# Altium schematic sheet FPGA_ETH.SchDoc
size A4; SheetNumber: 7; SheetTotal: 10
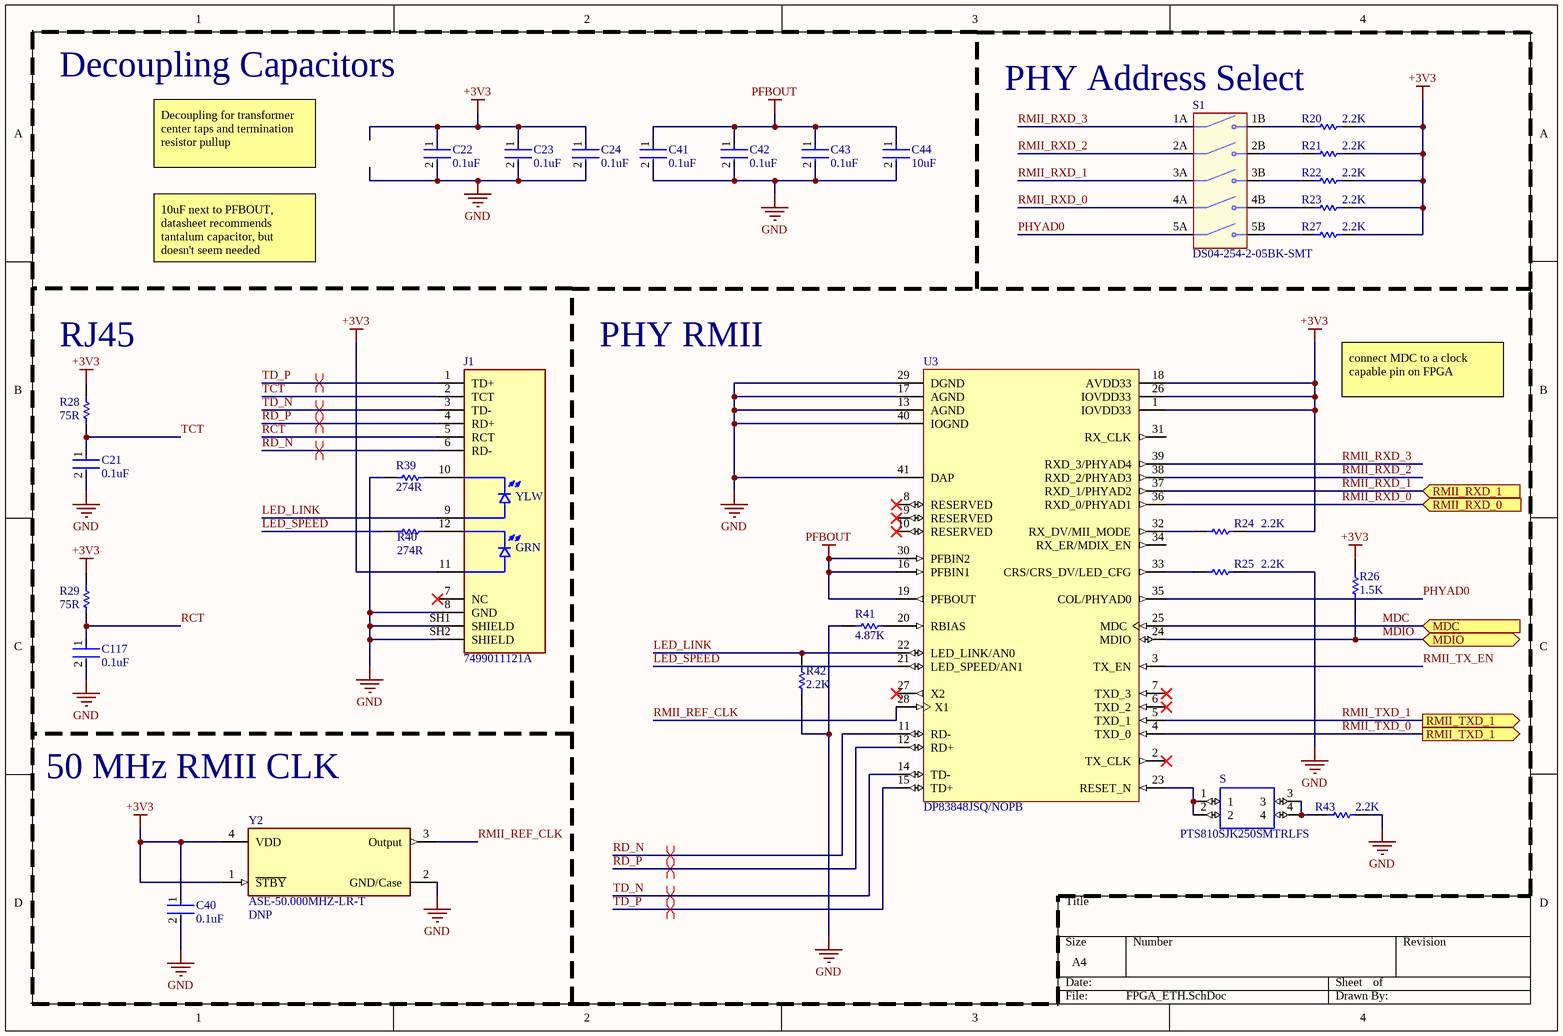
[diagram p0: FPGA_ETH.SchDoc]

## Parts
C21  0.1uF  [FP-CC0402-MFG]
C22  0.1uF  [FP-CC0402-MFG]
C23  0.1uF  [FP-CC0402-MFG]
C24  0.1uF  [FP-CC0402-MFG]
C40  0.1uF  [FP-CC0402-MFG]
C41  0.1uF  [FP-CC0402-MFG]
C42  0.1uF  [FP-CC0402-MFG]
C43  0.1uF  [FP-CC0402-MFG]
C44  10uF  [FP-GRM155-0_2-IPC_C]
C117  0.1uF  [FP-CC0402-MFG]
J1  7499011121A  [WE_7499011121A]
R20  2.2K  [RESC1005X40X25NL05T10]
R21  2.2K  [RESC1005X40X25NL05T10]
R22  2.2K  [RESC1005X40X25NL05T10]
R23  2.2K  [RESC1005X40X25NL05T10]
R24  2.2K  [RESC1005X40X25NL05T10]
R25  2.2K  [RESC1005X40X25NL05T10]
R26  1.5K  [RESC1005X40X25LL10T10]
R27  2.2K  [RESC1005X40X25NL05T10]
R28  75R  [RESC1608X55X25ML10T15]
R29  75R  [RESC1608X55X25ML10T15]
R39  274R  [RESC1608X55X25NL10T15]
R40  274R  [RESC1608X55X25NL10T15]
R41  4.87K  [RESC1005X40X25LL05T10]
R42  2.2K  [RESC1005X40X25NL05T10]
R43  2.2K  [RESC1005X40X25NL05T10]
S  PTS810SJK250SMTRLFS  [PTS810SJG250SMTRLFS]
S1  DS04-254-2-05BK-SMT  [SW_DS04-254-2-05BK-SMT]
U3  DP83848JSQ/NOPB  [RTA0040A_V]
Y2  ASE-50.000MHZ-LR-T  [FP-ASE-MFG]

## Ports
MDC (in), MDIO (bidir), RMII_RXD_0 (in), RMII_RXD_1 (in), RMII_TXD_1 (out)

## Nets
+3V3: C22.1 C23.1 C24.1 C40.1 J1.11(G_A) R20.2 R21.2 R22.2 R23.2 R24.2 R26.1 R27.2 R28.2 R29.2 U3.1(IOVDD33) U3.18(AVDD33) U3.26(IOVDD33) Y2.1(~{STBY}) Y2.4(VDD)
GND: C21.2 C22.2 C23.2 C24.2 C40.2 C41.2 C42.2 C43.2 C44.2 C117.2 J1.8(GND) J1.SH1(SHIELD) J1.SH2(SHIELD) R25.2 R39.2 R41.1 R42.2 R43.2 U3.13(AGND) U3.17(AGND) U3.29(DGND) U3.40(IOGND) U3.41(DAP) Y2.2(GND/Case)
PFBOUT: C41.1 C42.1 C43.1 C44.1 U3.16(PFBIN1) U3.19(PFBOUT) U3.30(PFBIN2)
LED_LINK: J1.9(Y_A) R42.1 U3.22(LED_LINK/AN0)
LED_SPEED: R40.2 U3.21(LED_SPEED/AN1)
MDC: U3.25(MDC) ; port MDC
MDIO: R26.2 U3.24(MDIO) ; port MDIO
PHYAD0: S1.5A(COM5) U3.35(COL/PHYAD0)
RCT: C117.1 J1.5(RCT) R29.1
RD_N: J1.6(RD-) U3.11(RD-)
RD_P: J1.4(RD+) U3.12(RD+)
RMII_REF_CLK: U3.28(X1) Y2.3(Output)
RMII_RXD_0: S1.4A(COM4) U3.36(RXD_0/PHYAD1) ; port RMII_RXD_0
RMII_RXD_1: S1.3A(COM3) U3.37(RXD_1/PHYAD2) ; port RMII_RXD_1
RMII_RXD_2: S1.2A(COM2) U3.38(RXD_2/PHYAD3)
RMII_RXD_3: S1.1A(COM1) U3.39(RXD_3/PHYAD4)
RMII_TX_EN: U3.3(TX_EN)
RMII_TXD_0: U3.4(TXD_0) U3.5(TXD_1) ; port RMII_TXD_1  [also labelled RMII_TXD_1]
TCT: C21.1 J1.2(TCT) R28.1
TD_N: J1.3(TD-) U3.14(TD-)
TD_P: J1.1(TD+) U3.15(TD+)
NetJ1_10: J1.10(Y_K) R39.1
NetJ1_12: J1.12(G_K) R40.1
NetR20_1: R20.1 S1.1B(NO1)
NetR21_1: R21.1 S1.2B(NO2)
NetR22_1: R22.1 S1.3B(NO3)
NetR23_1: R23.1 S1.4B(NO4)
NetR24_1: R24.1 U3.32(RX_DV/MII_MODE)
NetR25_1: R25.1 U3.33(CRS/CRS_DV/LED_CFG)
NetR27_1: R27.1 S1.5B(NO5)
NetR41_2: R41.2 U3.20(RBIAS)
NetR43_1: R43.1 S.3 S.4
NetS_1: S.1 S.2 U3.23(RESET_N)

Not connected (* = marked no-connect by the designer): J1 7(NC)*; U3 2(TX_CLK)* 6(TXD_2)* 7(TXD_3)* 8(RESERVED)* 9(RESERVED)* 10(RESERVED)* 27(X2)* 31(RX_CLK) 34(RX_ER/MDIX_EN)

## Layout directives
differential pair: RD_N, RD_P, TD_N, TD_P

## Notes on the sheet
- Decoupling Capacitors
- PHY Address Select
- Decoupling for transformer center taps and termination resistor pullup
- 10uF next to PFBOUT, datasheet recommends tantalum capacitor, but doesn't seem needed
- (near R28) RJ45
- PHY RMII
- connect MDC to a clock capable pin on FPGA
- 50 MHz RMII CLK
- (near Y2) DNP
- (in symbol 7499011121A) YLW; GRN

## Library data of the parts
C21-C24 C40-C43 C117 = CMP-03422-000048-1: CAP CER 0.1UF 16V X7R 0402; Manufacturer: YAGEO; Manufacturer Part Number: CC0402KRX7R7BB104; Material: Ceramic; Automotive Grade: NA; Capacitance: 100 nF; Temperature Coefficient: 30ppm/°C; Tolerance: 0.1; Value: 100 nF; Device Class L1: Passive Components; Temperature Range Low: -55°C; Device Class L3: Ceramic Capacitors; Temperature Characteristic: X7R; Ipc Land Pattern Name: CAPC10050X50; Temperature Range High: +125°C; Voltage Rating: 16 V; Temperature: -55°C to +125°C; RoHS: TRUE; Automotive: No; Height: 0.55mm; Device Class L2: Capacitors; Digikey Description: CAP CER 0.1UF 16V X7R 0402; Package: CC0402; Footprint Url: http://www.yageo.com/exep/pages/download/literatures/UPY-C_GEN_24.pdf; ComponentLink2Description: Datasheet; Category: Cap; Lead Free: Yes; Octopart: https://octopart.com/cc0402krx7r7bb104-yageo-42244624; ComponentLink2URL: http://www.yageo.com/documents/recent/UPY-GP_NP0_16V-to-50V_16.pdf; Mouser Description: 0402 0.1 uF 16 V ±10 % Tolerance X7R SMT Multilayer Ceramic Capacitor
C44 = CMP-06035-044652-1: Chip Multilayer Ceramic Capacitors for General Purpose, 0402, 10uF, X5R, 15%, 20%, 6.3V
J1 = 7499011121A: MF: {'manufacturer': u'W\xfcrth Elektronik'}; Package: None; Price: None; Value: *; MP: 7499011121A; Availability: Unavailable
R20-R25 R27 R42 R43 = CMP-2002-07567-1: Manufacturer: Yageo / Phycomp; Part Number: RC0402FR-072K2L
R26 = CMP-2002-05878-1: Manufacturer: Panasonic; Part Number: ERA2AEB152X
R28 R29 = CMP-1659-00045-1: Chip Resistor, 75 Ohm, +/- 1%, 0.1 W, -55 to 155 degC, 0603 (1608 Metric), RoHS, Tape and Reel; ComponentLink2URL: http://www.yageo.com/documents/recent/PYu-RC_Group_51_RoHS_L_04.pdf; ComponentLink1Description: Manufacturer URL; PackageReference: 0603; ComponentLink1URL: http://www.yageo.com/; ComponentLink2Description: Datasheet; PackageDescription: 2-Pin Surface Mount Device, Body 1.6 x 0.8 mm; DatasheetVersion: Rev. 4, 02/2016
R39 R40 = CMP-2000-03975-1: Manufacturer: Yageo; Part Number: RC0603FR-07274RL
R41 = CMP-2002-07716-1: Part Number: RC0402FR-074K87L; Manufacturer: Yageo / Phycomp
S = PTS810SJK250SMTRLFS: Tactile Switch SPST-NO Top Actuated Surface Mount; MF: C&K; SnapEDA_Link: https://www.snapeda.com/parts/PTS810SJK250SMTRLFS/C%26K/view-part/274682/?ref=snap; Package: None; Price: None; MP: PTS810SJK250SMTRLFS; Availability: Unavailable; Value: *
U3 = CMP-0058-00387-4: PHYTER® Mini LS Commercial Temperature Single Port 10/100 Mb/s Ethernet Transceiver, 40-pin LLP, Pb-Free, 250 Reel; Manufacturer: Texas Instruments; PowerWise: N; CompType: Interface IC; PackageTopMarking: NS*UZXYTTE#*83848JSQ; High-Reliability: Y; ComponentLink1URL: http://www.ti.com/general/docs/lit/getliterature.tsp?genericPartNumber=DP83848J&fileType=pdf; PackageReference: RTA0040A; RoHS: Y; PinCount: 40; PartNumber: DP83848JSQ/NOPB; ComponentLink1Description: Datasheet URL; PackageDescription: LLP, Quad, 6 x 6 x 0.8mm, 40 Lead, Small DAP, 0.5mm Pitch, No Pullback
Y2 = CMP-27762-004169-1: XTAL Oscillator 50MHz ±25ppm CMOS 3.3V 4-SMD 3.2mm x 2.5mm; Max Supply Voltage: 3.465V; Min Supply Voltage: 3.135V; Max Supply Current: 19mA; Load Capacitance: 15pF; Width: 0.098inch; Min Operating Temperature: -40°C; Number of Pins: 4; Frequency: 50MHz; Case/Package: SMD/SMT; REACH SVHC: No SVHC; Height: 0.047inch; Frequency Stability: 25ppm; Mount: Surface Mount; Package Quantity: 1000; Operating Supply Voltage: 3.3V; Max Operating Temperature: 85°C; Packaging: Tape and Reel; Length: 0.126inch; Series: ASE
S1 = DS04-254-2-05BK-SMT: Value: *; Price: None; Package: None; Availability: Unavailable; MP: DS04-254-2-05BK-SMT